# EAGLE schematic Adafruit MONSTER M4SK (EAGLE 9.4.2)

## Sheet 1 of 3: Microcontroller + Power
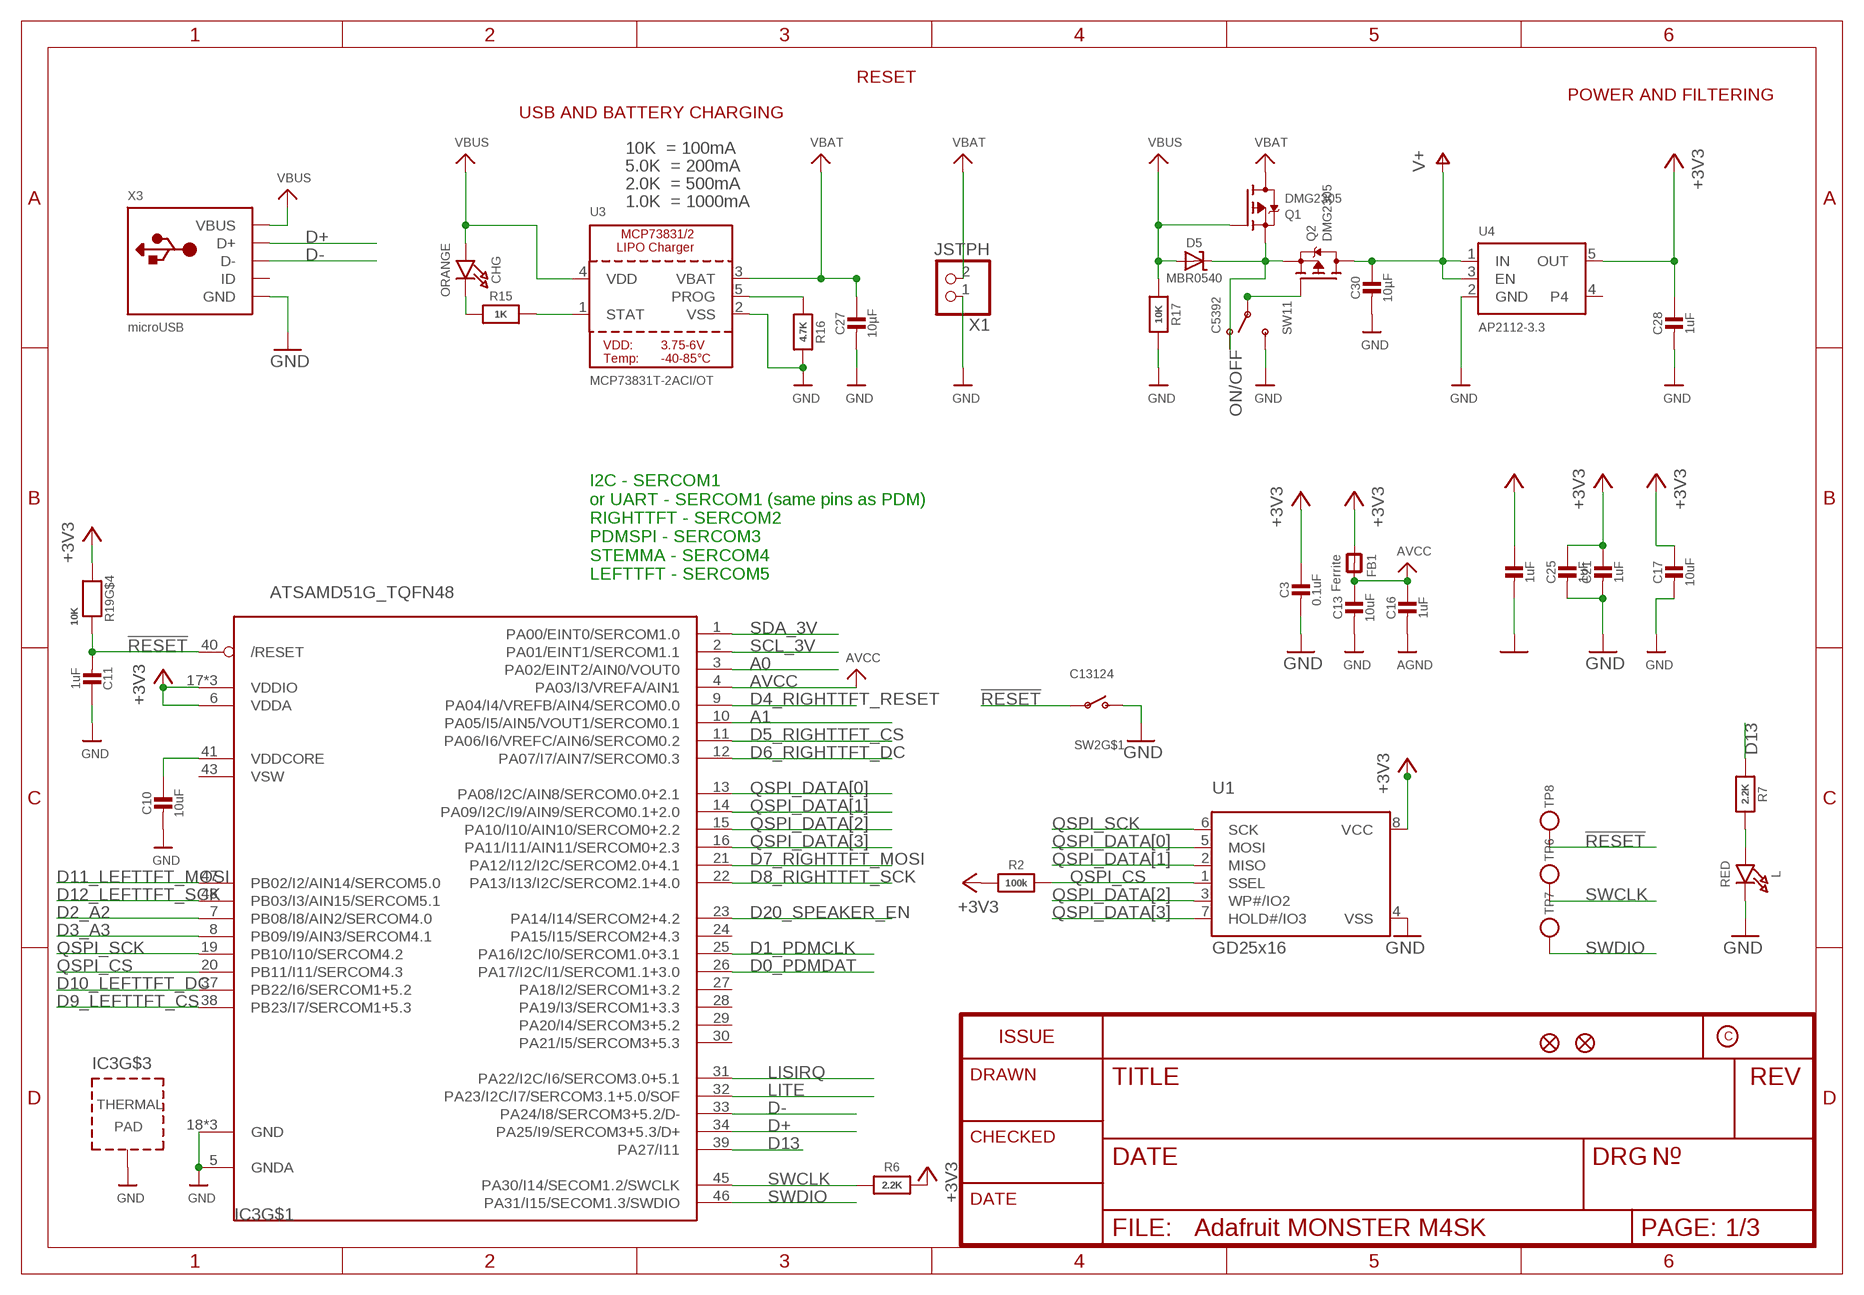
[diagram p0: schematic, sheet 1]

### Parts
C3  0.1uF  CAP_CERAMIC0603_NO  [0603-NO]
C10  10uF  CAP_CERAMIC_0805MP  [_0805MP]
C11  1uF  CAP_CERAMIC0603_NO  [0603-NO]
C13  10uF  CAP_CERAMIC0805-NOOUTLINE  [0805-NO]
C16  1uF  CAP_CERAMIC0603_NO  [0603-NO]
C17  10uF  CAP_CERAMIC0805-NOOUTLINE  [0805-NO]
C19  1uF  CAP_CERAMIC0603_NO  [0603-NO]
C21  1uF  CAP_CERAMIC0603_NO  [0603-NO]
C25  1uF  CAP_CERAMIC0603_NO  [0603-NO]
C27  10µF  CAP_CERAMIC0805-NOOUTLINE  [0805-NO]
C28  1uF  CAP_CERAMIC0603_NO  [0603-NO]
C30  10µF  CAP_CERAMIC0805-NOOUTLINE  [0805-NO]
CHG  ORANGE  LED0805_NOOUTLINE  [CHIPLED_0805_NOOUTLINE]
D5  MBR0540  DIODE-SCHOTTKYSOD-123  [SOD-123]
FB1  Ferrite  FERRITE-0805NO  [0805-NO]
IC3  ATSAMD51G_TQFN48  [TQFN48_7MM]
L  RED  LED0805_NOOUTLINE  [CHIPLED_0805_NOOUTLINE]
Q1  DMG2305  MOSFET-P  [SOT23-R]
Q2  DMG2305  MOSFET-P  [SOT23-R]
R2  100k  RESISTOR_0603_NOOUT  [0603-NO]
R6  2.2K  RESISTOR_0603_NOOUT  [0603-NO]
R7  2.2K  RESISTOR_0603_NOOUT  [0603-NO]
R15  1K  RESISTOR_0603_NOOUT  [0603-NO]
R16  4.7K  RESISTOR_0603_NOOUT  [0603-NO]
R17  10K  RESISTOR_0603_NOOUT  [0603-NO]
R19  10K  RESISTOR_4PACK  [RESPACK_4X0603]
SW2  C13124  SWITCH_SPST_TACT_RA  [SPST_TACTILE_RA]
SW11  C5392  SWITCH_SPDT  [SPDT_SMT_SSSS811101]
TP6  TESTPOINTROUND2MMNO  [TESTPOINT_ROUND_2MM_NO]
TP7  TESTPOINTROUND2MMNO  [TESTPOINT_ROUND_2MM_NO]
TP8  TESTPOINTROUND2MMNO  [TESTPOINT_ROUND_2MM_NO]
U1  GD25x16  SPIFLASH_8PIN208MIL  [SOIC8_208MIL]
U3  MCP73831T-2ACI/OT  MCP73831/2  [SOT23-5]
U4  AP2112-3.3  VREG_SOT23-5  [SOT23-5]
U$34  FIDUCIAL_1MM  [FIDUCIAL_1MM]
U$35  FIDUCIAL_1MM  [FIDUCIAL_1MM]
X1  JSTPH  CON_JST_PH_2PIN  [JSTPH2]
X3  microUSB  USB_MICRO_NARROW  [4UCONN_20329_NARROW]

### Nets
!RESET: C11.2 IC3.40(/RESET) R19.5 SW2.1(P) TP8.P$1
+3V3 [power]: C3.1 C17.1 C19.1 C21.1 C25.1 C28.1 FB1.1 IC3.6(VDDA) IC3.17(VDDIO) IC3.36(VDDIO) IC3.44(VDDIO) R2.1 R6.2 R19.4 U1.8(VCC) U4.5(OUT) ; also sheet 2
A0: IC3.3(PA02/EINT2/AIN0/VOUT0) ; also sheet 2
A1: IC3.10(PA05/I5/AIN5/VOUT1/SERCOM0.1) ; also sheet 2
AGND: C16.2 ; also sheet 2
AVCC: C13.1 C16.1 FB1.2 IC3.4(PA03/I3/VREFA/AIN1)
CHG_LED: R15.2 U3.1(STAT)
CHG_RATE: R16.1 U3.5(PROG)
D0_PDMDAT: IC3.26(PA17/I2C/I1/SERCOM1.1+3.0) ; also sheet 2
D1_PDMCLK: IC3.25(PA16/I2C/I0/SERCOM1.0+3.1) ; also sheet 2
D2_A2: IC3.7(PB08/I8/AIN2/SERCOM4.0) ; also sheet 2,3
D3_A3: IC3.8(PB09/I9/AIN3/SERCOM4.1) ; also sheet 2
D4_RIGHTTFT_RESET: IC3.9(PA04/I4/VREFB/AIN4/SERCOM0.0) ; also sheet 2
D5_RIGHTTFT_CS: IC3.11(PA06/I6/VREFC/AIN6/SERCOM0.2) ; also sheet 2
D6_RIGHTTFT_DC: IC3.12(PA07/I7/AIN7/SERCOM0.3) ; also sheet 2
D7_RIGHTTFT_MOSI: IC3.21(PA12/I12/I2C/SERCOM2.0+4.1) ; also sheet 2
D8_RIGHTTFT_SCK: IC3.22(PA13/I13/I2C/SERCOM2.1+4.0) ; also sheet 2
D9_LEFTTFT_CS: IC3.38(PB23/I7/SERCOM1+5.3) ; also sheet 2,3
D10_LEFTTFT_DC: IC3.37(PB22/I6/SERCOM1+5.2) ; also sheet 2,3
D11_LEFTTFT_MOSI: IC3.47(PB02/I2/AIN14/SERCOM5.0) ; also sheet 2,3
D12_LEFTTFT_SCK: IC3.48(PB03/I3/AIN15/SERCOM5.1) ; also sheet 2,3
D13: IC3.39(PA27/I11) R7.1
D20_SPEAKER_EN: IC3.23(PA14/I14/SERCOM2+4.2) ; also sheet 2
D+: IC3.34(PA25/I9/SERCOM3+5.3/D+) X3.D+
D-: IC3.33(PA24/I8/SERCOM3+5.2/D-) X3.D-
GND: C3.2 C10.2 C11.1 C13.2 C17.2 C19.2 C21.2 C25.2 C27.2 C28.2 C30.2 IC3.5(GNDA) IC3.18(GND) IC3.35(GND) IC3.42(GND) IC3.THERMAL(TP) L.C R16.2 R17.2 SW2.2(S) SW11.C(S) U1.4(VSS) U3.2(VSS) U4.2(GND) X1.1 X3.BASE@1(GND) X3.BASE@2(GND) X3.GND X3.SPRT@1(GND) X3.SPRT@2(GND) X3.SPRT@3(GND) X3.SPRT@4(GND) ; also sheet 2,3
LISIRQ: IC3.31(PA22/I2C/I6/SERCOM3.0+5.1) ; also sheet 2
LITE: IC3.32(PA23/I2C/I7/SERCOM3.1+5.0/SOF) ; also sheet 2
N$2: L.A R7.2
N$3: CHG.C R15.1
N$8: D5.C Q1.2(S) Q2.2(S) SW11.A(O)
ON/OFF: Q2.1(G) SW11.B(P)
QSPI_CS: IC3.20(PB11/I11/SERCOM4.3) R2.2 U1.1(SSEL)
QSPI_DATA[0]: IC3.13(PA08/I2C/AIN8/SERCOM0.0+2.1) U1.5(MOSI)
QSPI_DATA[1]: IC3.14(PA09/I2C/I9/AIN9/SERCOM0.1+2.0) U1.2(MISO)
QSPI_DATA[2]: IC3.15(PA10/I10/AIN10/SERCOM0+2.2) U1.3(WP#/IO2)
QSPI_DATA[3]: IC3.16(PA11/I11/AIN11/SERCOM0+2.3) U1.7(HOLD#/IO3)
QSPI_SCK: IC3.19(PB10/I10/SERCOM4.2) U1.6(SCK)
SCL_3V: IC3.2(PA01/EINT1/SERCOM1.1) ; also sheet 2,3
SDA_3V: IC3.1(PA00/EINT0/SERCOM1.0) ; also sheet 2,3
SWCLK: IC3.45(PA30/I14/SECOM1.2/SWCLK) R6.1 TP6.P$1
SWDIO: IC3.46(PA31/I15/SECOM1.3/SWDIO) TP7.P$1
V+ [power]: C30.1 Q2.3(D) U4.1(IN) U4.3(EN) ; also sheet 2,3
VBAT: C27.1 Q1.3(D) U3.3(VBAT) X1.2
VBUS: CHG.A D5.A Q1.1(G) R17.1 U3.4(VDD) X3.VBUS
VDDCORE: C10.1 IC3.41(VDDCORE)
Unconnected: IC3.24(PA15/I15/SERCOM2+4.3) IC3.27(PA18/I2/SERCOM1+3.2) IC3.28(PA19/I3/SERCOM1+3.3) IC3.29(PA20/I4/SERCOM3+5.2) IC3.30(PA21/I5/SERCOM3+5.3) SW2.MT1(MT) SW2.MT2(MT) U4.4 X3.ID

### Notes on the sheet
- RESET
- POWER AND FILTERING
- USB AND BATTERY CHARGING
- 10K  = 100mA
- 5.0K  = 200mA
- 2.0K  = 500mA
- 1.0K  = 1000mA
- I2C - SERCOM1
  or UART - SERCOM1 (same pins as PDM)
  RIGHTTFT - SERCOM2
  PDMSPI - SERCOM3
  STEMMA - SERCOM4
  LEFTTFT - SERCOM5

## Sheet 2 of 3: Right TFT + Audio
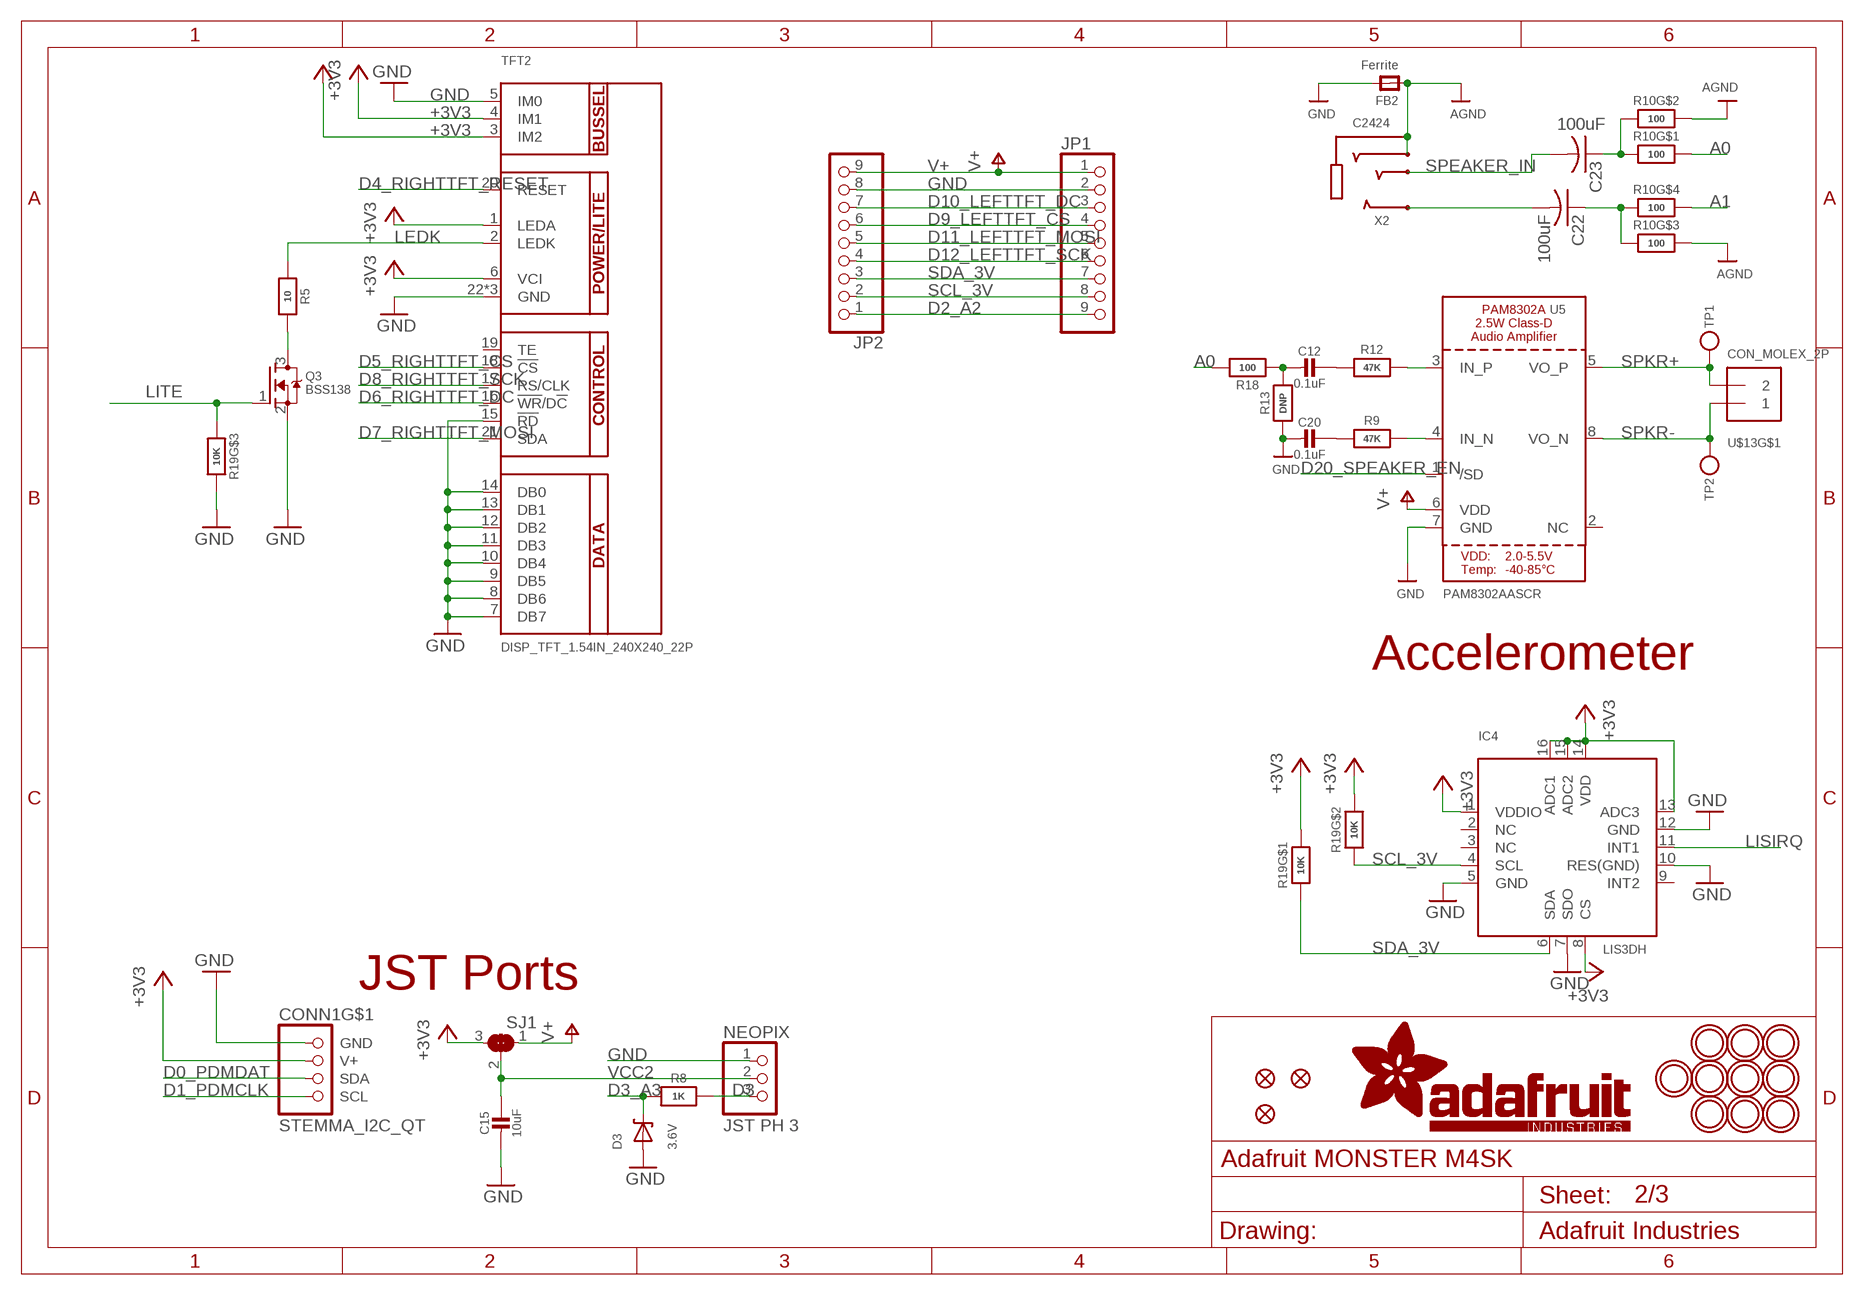
[diagram p1: schematic, sheet 2]

### Parts
C12  0.1uF  CAP_CERAMIC0603_NO  [0603-NO]
C15  10uF  CAP_CERAMIC0805-NOOUTLINE  [0805-NO]
C20  0.1uF  CAP_CERAMIC0603_NO  [0603-NO]
C22  100uF  C-USC1210  [C1210]
C23  100uF  C-USC1210  [C1210]
CONN1  STEMMA_I2C_QT  [JST_SH4]
D3  3.6V  DIODE-ZENERSOD323  [SOD-323]
FB2  Ferrite  FERRITE_0805MP  [_0805MP]
IC4  LIS3DH  ACCEL_LIS3DHTR  [LGA16_3X3MM]
JP1  HEADER-1X9_JSTSH  [JST_SH9]
JP2  HEADER-1X9_JSTSH  [JST_SH9]
NEOPIX  JST PH 3  CON_JST_PH_3PIN  [JSTPH3]
Q3  BSS138  MOSFET-NWIDE  [SOT23-WIDE]
R5  10  RESISTOR_0603_NOOUT  [0603-NO]
R8  1K  RESISTOR_0603_NOOUT  [0603-NO]
R9  47K  RESISTOR_0603_NOOUT  [0603-NO]
R10  100  RESISTOR_4PACK  [RESPACK_4X0603]
R12  47K  RESISTOR_0603_NOOUT  [0603-NO]
R13  DNP  RESISTOR_0603_NOOUT  [0603-NO]
R18  100  RESISTOR_0603_NOOUT  [0603-NO]
SJ1  SOLDERJUMPER_2WAY  [SOLDERJUMPER_2WAY_OPEN_NOPASTE]
TFT2  DISP_TFT_1.54IN_240X240_22P  [TFT_1.54IN_240X240_22PIN]
TP1  TESTPOINTROUND1.5MMNO  [TESTPOINT_ROUND_1.5MM_NO]
TP2  TESTPOINTROUND1.5MMNO  [TESTPOINT_ROUND_1.5MM_NO]
U5  PAM8302AASCR  AUDIOAMP_PAM8302A  [MSOP8_0.65MM]
U$3  FIDUCIAL_1MM  [FIDUCIAL_1MM]
U$4  FIDUCIAL_1MM  [FIDUCIAL_1MM]
U$5  FIDUCIAL_1MM  [FIDUCIAL_1MM]
U$7  MOUNTINGHOLE3.0THIN  [MOUNTINGHOLE_3.0_PLATEDTHIN]
U$8  MOUNTINGHOLE3.0THIN  [MOUNTINGHOLE_3.0_PLATEDTHIN]
U$9  MOUNTINGHOLE3.0THIN  [MOUNTINGHOLE_3.0_PLATEDTHIN]
U$10  MOUNTINGHOLE3.0THIN  [MOUNTINGHOLE_3.0_PLATEDTHIN]
U$13  CON_MOLEX_2P  [53398-0271]
U$58  MOUNTINGHOLE3.0THIN  [MOUNTINGHOLE_3.0_PLATEDTHIN]
U$59  MOUNTINGHOLE3.0THIN  [MOUNTINGHOLE_3.0_PLATEDTHIN]
U$60  MOUNTINGHOLE3.0THIN  [MOUNTINGHOLE_3.0_PLATEDTHIN]
U$61  MOUNTINGHOLE3.0THIN  [MOUNTINGHOLE_3.0_PLATEDTHIN]
U$63  MOUNTINGHOLE3.0THIN  [MOUNTINGHOLE_3.0_PLATEDTHIN]
U$64  MOUNTINGHOLE3.0THIN  [MOUNTINGHOLE_3.0_PLATEDTHIN]
X2  C2424  AUDIO_3.5MMJACK_4POL  [4UCONN_18510]

### Nets
+3V3 [power]: CONN1.2(V+) IC4.1(VDDIO) IC4.8(CS) IC4.13(ADC3) IC4.14(VDD) IC4.15(ADC2) IC4.16(ADC1) R19.1 R19.2 SJ1.3 TFT2.1(LEDA) TFT2.3(IM2) TFT2.4(IM1) TFT2.6(VCI) ; also sheet 1
A0: R10.8 R18.2 ; also sheet 1
A1: R10.5 ; also sheet 1
AGND: FB2.1 R10.6 R10.7 X2.1-GND(TIP) X2.4-INNER_SLEEVE(RING1) ; also sheet 1
D0_PDMDAT: CONN1.3(SDA) ; also sheet 1
D1_PDMCLK: CONN1.4(SCL) ; also sheet 1
D2_A2: JP1.9 JP2.1 ; also sheet 1,3
D3: NEOPIX.3 R8.1
D3_A3: D3.C R8.2 ; also sheet 1
D4_RIGHTTFT_RESET: TFT2.20(RESET) ; also sheet 1
D5_RIGHTTFT_CS: TFT2.18(!CS) ; also sheet 1
D6_RIGHTTFT_DC: TFT2.16(!WR!/D!C) ; also sheet 1
D7_RIGHTTFT_MOSI: TFT2.21(SDA) ; also sheet 1
D8_RIGHTTFT_SCK: TFT2.17(RS/CLK) ; also sheet 1
D9_LEFTTFT_CS: JP1.4 JP2.6 ; also sheet 1,3
D10_LEFTTFT_DC: JP1.3 JP2.7 ; also sheet 1,3
D11_LEFTTFT_MOSI: JP1.5 JP2.5 ; also sheet 1,3
D12_LEFTTFT_SCK: JP1.6 JP2.4 ; also sheet 1,3
D20_SPEAKER_EN: U5.1(/SD) ; also sheet 1
GND: C15.2 C20.2 CONN1.1(GND) D3.A FB2.2 IC4.5(GND) IC4.7(SDO) IC4.10(RES(GND)) IC4.12(GND) JP1.2 JP2.8 NEOPIX.1 Q3.2(S) R13.1 R19.3 TFT2.5(IM0) TFT2.7(DB7) TFT2.8(DB6) TFT2.9(DB5) TFT2.10(DB4) TFT2.11(DB3) TFT2.12(DB2) TFT2.13(DB1) TFT2.14(DB0) TFT2.15(!RD) TFT2.22(GND) TFT2.SUPPORT1(GND) TFT2.SUPPORT2(GND) U5.7(GND) ; also sheet 1,3
LEDK: R5.2 TFT2.2(LEDK)
LISIRQ: IC4.11(INT1) ; also sheet 1
LITE: Q3.1(G) R19.6 ; also sheet 1
N$1: Q3.3(D) R5.1
N$9: R9.2 U5.4(IN_N)
N$10: R12.2 U5.3(IN_P)
N$13: C12.2 R13.2 R18.1
N$14: C22.2 X2.3-OUTER_SLEEVE(RING2)
N$15: C22.1 R10.3 R10.4
N$16: C20.1 R9.1
N$17: C12.1 R12.1
N$70: C23.1 R10.1 R10.2
SCL_3V: IC4.4(SCL) JP1.8 JP2.2 R19.7 ; also sheet 1,3
SDA_3V: IC4.6(SDA) JP1.7 JP2.3 R19.8 ; also sheet 1,3
SPEAKER_IN: C23.2 X2.2-TIP(RING3)
SPKR+: TP1.P$1 U5.5(VO_P) U$13.2
SPKR-: TP2.P$1 U5.8(VO_N) U$13.1
V+ [power]: JP1.1 JP2.9 SJ1.1 U5.6(VDD) ; also sheet 1,3
VCC2 [power]: C15.1 NEOPIX.2 SJ1.2
Unconnected: CONN1.MT1(MT) CONN1.MT2(MT) IC4.2(NC) IC4.3(NC) IC4.9(INT2) TFT2.19(TE) U5.2(NC) U$13.M1(MT) U$13.M2(MT)

### Notes on the sheet
- Accelerometer
- JST Ports

## Sheet 3 of 3: Left TFT Side
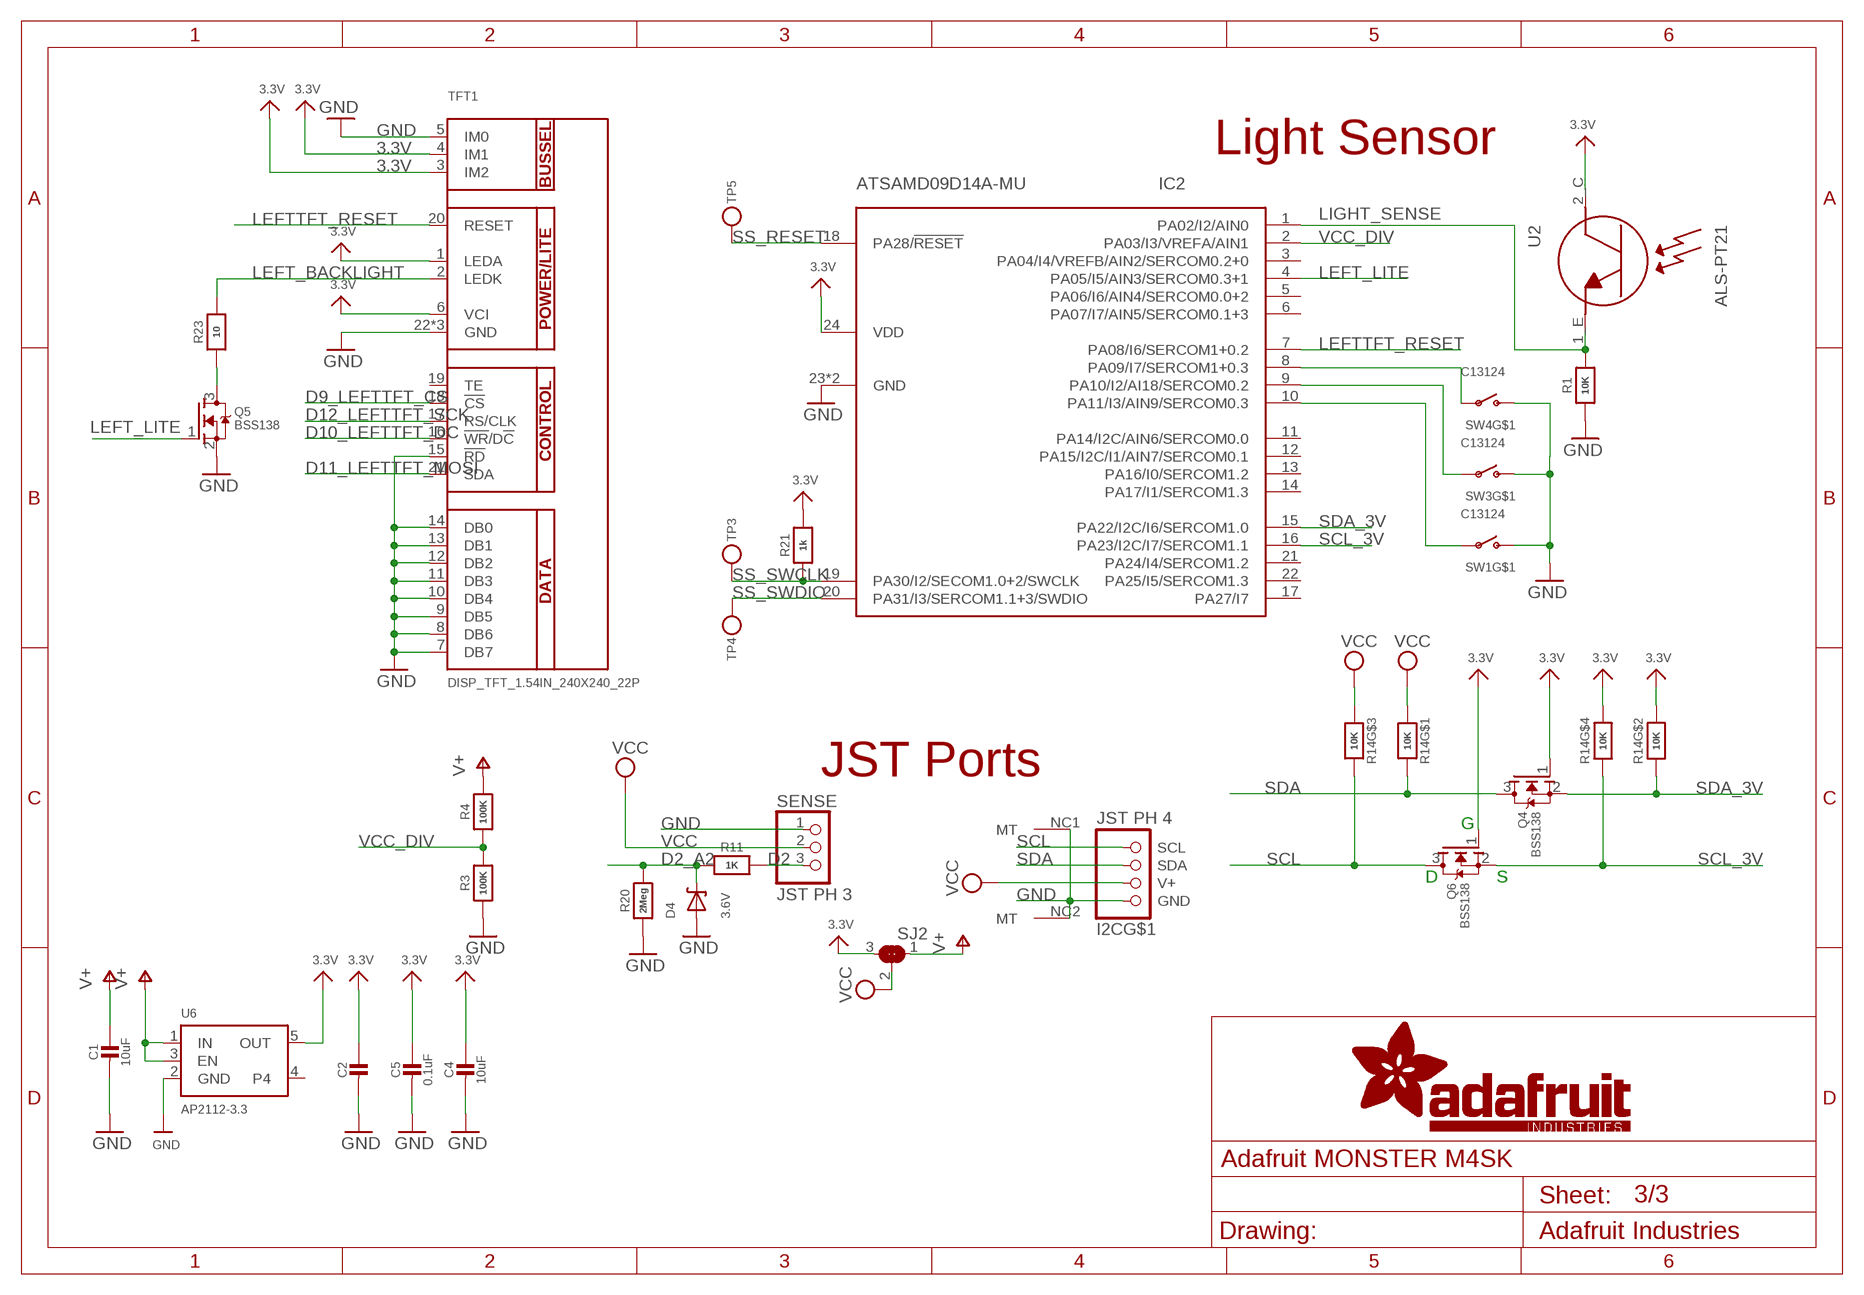
[diagram p2: schematic, sheet 3]

### Parts
C1  10uF  CAP_CERAMIC0805-NOOUTLINE  [0805-NO]
C2  10uF  CAP_CERAMIC0805-NOOUTLINE  [0805-NO]
C4  10uF  CAP_CERAMIC0805-NOOUTLINE  [0805-NO]
C5  0.1uF  CAP_CERAMIC0603_NO  [0603-NO]
D4  3.6V  DIODE-ZENERSOD323  [SOD-323]
I2C  JST PH 4  STEMMA_I2C_RASMT  [JSTPH4]
IC2  ATSAMD09D14A-MU  [QFN24_4MM]
Q4  BSS138  MOSFET-NWIDE  [SOT23-WIDE]
Q5  BSS138  MOSFET-NWIDE  [SOT23-WIDE]
Q6  BSS138  MOSFET-NWIDE  [SOT23-WIDE]
R1  10K  RESISTOR_0603_NOOUT  [0603-NO]
R3  100K  RESISTOR_0603_NOOUT  [0603-NO]
R4  100K  RESISTOR_0603_NOOUT  [0603-NO]
R11  1K  RESISTOR_0603_NOOUT  [0603-NO]
R14  10K  RESISTOR_4PACK  [RESPACK_4X0603]
R20  2Meg  RESISTOR_0603_NOOUT  [0603-NO]
R21  1k  RESISTOR_0603_NOOUT  [0603-NO]
R23  10  RESISTOR_0603_NOOUT  [0603-NO]
SENSE  JST PH 3  CON_JST_PH_3PIN  [JSTPH3]
SJ2  SOLDERJUMPER_2WAY  [SOLDERJUMPER_2WAY_OPEN_NOPASTE]
SW1  C13124  SWITCH_SPST_TACT_RA  [SPST_TACTILE_RA]
SW3  C13124  SWITCH_SPST_TACT_RA  [SPST_TACTILE_RA]
SW4  C13124  SWITCH_SPST_TACT_RA  [SPST_TACTILE_RA]
TFT1  DISP_TFT_1.54IN_240X240_22P  [TFT_1.54IN_240X240_22PIN]
TP3  TESTPOINTROUND2MM  [TESTPOINT_ROUND_2MM]
TP4  TESTPOINTROUND2MM  [TESTPOINT_ROUND_2MM]
TP5  TESTPOINTROUND2MM  [TESTPOINT_ROUND_2MM]
U2  ALS-PT21  PHOTOTRANSISTOR_PT26-21C  [ALS-PT26-21C]
U6  AP2112-3.3  VREG_SOT23-5  [SOT23-5]

### Nets
3.3V: C2.1 C4.1 C5.1 IC2.24(VDD) Q4.1(G) Q6.1(G) R14.2 R14.4 R21.2 SJ2.3 TFT1.1(LEDA) TFT1.3(IM2) TFT1.4(IM1) TFT1.6(VCI) U2.2_C(C) U6.5(OUT)
D2: R11.1 SENSE.3
D2_A2: D4.C R11.2 R20.2 ; also sheet 1,2
D9_LEFTTFT_CS: TFT1.18(!CS) ; also sheet 1,2
D10_LEFTTFT_DC: TFT1.16(!WR!/D!C) ; also sheet 1,2
D11_LEFTTFT_MOSI: TFT1.21(SDA) ; also sheet 1,2
D12_LEFTTFT_SCK: TFT1.17(RS/CLK) ; also sheet 1,2
GND: C1.2 C2.2 C4.2 C5.2 D4.A I2C.1(GND) I2C.NC1(MT) I2C.NC2(MT) IC2.23(GND) IC2.THERM(GND) Q5.2(S) R1.1 R3.1 R20.1 SENSE.1 SW1.2(S) SW3.2(S) SW4.2(S) TFT1.5(IM0) TFT1.7(DB7) TFT1.8(DB6) TFT1.9(DB5) TFT1.10(DB4) TFT1.11(DB3) TFT1.12(DB2) TFT1.13(DB1) TFT1.14(DB0) TFT1.15(!RD) TFT1.22(GND) TFT1.SUPPORT1(GND) TFT1.SUPPORT2(GND) U6.2(GND) ; also sheet 1,2
LEFT_BACKLIGHT: R23.2 TFT1.2(LEDK)
LEFT_LITE: IC2.4(PA05/I5/AIN3/SERCOM0.3+1) Q5.1(G)
LEFTTFT_RESET: IC2.7(PA08/I6/SERCOM1+0.2) TFT1.20(RESET)
LIGHT_SENSE: IC2.1(PA02/I2/AIN0) R1.2 U2.1_E(E)
N$6: Q5.3(D) R23.1
N$7: IC2.8(PA09/I7/SERCOM1+0.3) SW4.1(P)
N$11: IC2.9(PA10/I2/AI18/SERCOM0.2) SW3.1(P)
N$12: IC2.10(PA11/I3/AIN9/SERCOM0.3) SW1.1(P)
SCL: I2C.4(SCL) Q6.3(D) R14.6
SCL_3V: IC2.16(PA23/I2C/I7/SERCOM1.1) Q6.2(S) R14.5 ; also sheet 1,2
SDA: I2C.3(SDA) Q4.3(D) R14.8
SDA_3V: IC2.15(PA22/I2C/I6/SERCOM1.0) Q4.2(S) R14.7 ; also sheet 1,2
SS_RESET: IC2.18(PA28/!RESET) TP5.P$1
SS_SWCLK: IC2.19(PA30/I2/SECOM1.0+2/SWCLK) R21.1 TP3.P$1
SS_SWDIO: IC2.20(PA31/I3/SERCOM1.1+3/SWDIO) TP4.P$1
V+ [power]: C1.1 R4.2 SJ2.1 U6.1(IN) U6.3(EN) ; also sheet 1,2
VCC [power]: I2C.2(V+) R14.1 R14.3 SENSE.2 SJ2.2
VCC_DIV: IC2.2(PA03/I3/VREFA/AIN1) R3.2 R4.1
Unconnected: IC2.3(PA04/I4/VREFB/AIN2/SERCOM0.2+0) IC2.5(PA06/I6/AIN4/SERCOM0.0+2) IC2.6(PA07/I7/AIN5/SERCOM0.1+3) IC2.11(PA14/I2C/AIN6/SERCOM0.0) IC2.12(PA15/I2C/I1/AIN7/SERCOM0.1) IC2.13(PA16/I0/SERCOM1.2) IC2.14(PA17/I1/SERCOM1.3) IC2.17(PA27/I7) IC2.21(PA24/I4/SERCOM1.2) IC2.22(PA25/I5/SERCOM1.3) SW1.MT1(MT) SW1.MT2(MT) SW3.MT1(MT) SW3.MT2(MT) SW4.MT1(MT) SW4.MT2(MT) TFT1.19(TE) U6.4

### Notes on the sheet
- Light Sensor
- JST Ports
- G
- D | S

## Power pins joined to a net without a drawn wire
VSW: IC3.43(VSW)

## Library data of the parts
C1-C5 C10-C13 C15-C17 C19-C21 C25 C27 C28 C30 = microbuilder:CAP_CERAMIC: Ceramic Capacitors For new designs, use the packages preceded by an '_' character since they are more reliable: The following footprints should be used on most boards: _0402 - Standard footprint for regular board layouts _0603 - Standard footprint for regular board layouts _0805 - Standard footprint for regular board layouts _1206 - Standard footprint for regular board layouts For extremely tight-pitch boards where space is at a premium, the following 'micro-pitch' footprints can be used (smaller pads, no silkscreen outline, etc.): _0402MP - Micro-pitch footprint for very dense/compact boards _0603MP - Micro-pitch footprint for very dense/compact boards _0805MP - Micro-pitch footprint for very dense/compact boards _1206MP - Micro-pitch footprint for very dense/compact boards
C22 C23 = resistor:C-US: CAPACITOR, American symbol
CHG L = microbuilder:LED: LED 0603 - 0603 Surface Mount Package 2mA: Green LED - Low Power (3.9mcd, 2ma, 1.7Vf) - Digikey: 475-2709-2-ND Orange LED - Low Power (9.8mcd, 2ma, 1.8Vf) - Digikey: 475-1194-2-ND Red LED - Low Power (5mcd, 2ma, 1.8Vf) - Digikey: 475-1195-2-ND Yellow LED - Low Power (7mcd, 2ma, 1.8Vf) - Digikey: 475-1196-2-ND 5mA: Blue LED - Low Power (17mcd, 5ma, 2.9Vf) - Digikey: LNJ937W8CRACT-ND 0805 - 0805 Surface Mount Package 2mA: Red LED (8.8mcd, 2mA, 1.8Vf, Clear) - Low Power [Digikey: 475-2510-1-ND] Green LED (5mcd, 2mA, 1.8Vf, Clear) - Low Power [Digikey: 475-2730-1-ND] Yellow LED (11.3mcd, 2mA, 1.8Vf, Clear) - Low Power [Digikey: 475-2555-1-ND] 20mA: Red LED (104mcd, 20mA, Diffused) - LS R976 [Digikey: 475-1278-6-ND] Red LED (12mcd, 20mA, 2.0Vf, Clear) - APT2012EC [Digikey: 754-1128-1-ND] Green LED (15mcd, 20mA, 2.2Vf, Clear) - APT2012GC [Digikey: 754-1131-1-ND] Orange LED (160mcd, 20mA, 2.1Vf, Clear) - APT2012SECK [Digikey: 754-1130-1-ND] 1206 - 1206 Surface Mount Package Green LED (26mcd, 20mA, Diffused) - LG N971 [Digikey: 475-1407-6-ND] Red LED (15mcd, 20mA, Diffused) - LH N974 [Digikey: 475-1416-6-ND] Cree - Cree High-Power Surface Mount LEDs XPEBWT-L1-0000-00D50 - White 111lm 350mA 2.9Vf 6200K 110° XTEAWT-00-0000-00000LEE3 - White 114lm 350mA 2.85Vf 5000K 115° Everlight - Everlight 45-21 Series Surface Mount LEDs 45-21/QK2C-B2832AC2CB2/2T - Warm White 2000mcd 20mA 3.25Vf 3050K 120° 45-21/LK2C-B38452C4CB2/2T - Nuetral White 2000mcd 20mA 3.25Vf 4150K 120° 45-21/LK2C-B50634C6CB2/2T - Cold White 2200mcd 20mA 3.25Vf 5650K 120° PLCC2 Reverse Mount LS T77K-J1L2-1-0-2-R18-Z - Red 11.25mcd 2mA 1.8Vf 630nm 120° LO T77K-L1M2-24-Z - Orange 19.6mcd 2mA 1.8Vf 606nm 120° LY T77K-K2M1-26-Z - Yellow 15.7mcd 2mA 1.8Vf 587nm 120°
CONN1 I2C = microbuilder:STEMMA_I2C
D3 D4 = microbuilder:DIODE-ZENER: Zener Diode SMA: 30V 1W Zener Diode, 1.2Vf - Digikey: SMAZ30-FDICT-ND
D5 = microbuilder:DIODE-SCHOTTKY
FB1 FB2 = microbuilder:FERRITE: Ferrite Bead 0603 MMZ1608B121C - 120 Ohm @ 100MHz, 600mA, 0.15 Ohm DC Resistance - Digikey: 445-2164-1-ND BK1608HW121-T - 120 Ohm, 600mA Ferrite Chip - Digikey: 587-1876-2-ND 0805 HZ0805B272R-10 - 2.7K Ohm @ 100MHz, 200mA, 0.8 Ohm DC Resistance - Digikey: 240-2504-1-ND (see also Murata BLM21BD272SN1L) MMZ2012Y152B - 1.5K Ohm @ 100MHz, 500mA, 0.4 Ohm DC Resistance - Digikey: 445-1560-1-ND - Mainly for high frequency (80-400MHz) MMZ2012R102A - 1K Ohm @ 100MHz, 500mA, 0.3 Ohm DC Resistance - Digikey: 445-1555-2-ND - More general purpose (10-200MHz)
IC2 = microbuilder:ATSAMD09D14A
IC3 = microbuilder:ATSAMD51G
IC4 = microbuilder:ACCEL_LIS3DHTR: LIS3DHTR 3-Axis Accelerometer with I2C/SPI Interface VDD: 1.71-3.6V VDDIO: 1.71-VDD+0.1V Scale: +/-2g, 4g, 8g, 16g with 16--bit data output Temp:: -40°C - 85°C Mouser: 511-LIS3DHTR Digikey: 497-10613-1-ND
JP1 JP2 = microbuilder:HEADER-1X9: PIN HEADER
NEOPIX SENSE = microbuilder:CON_JST_PH_3PIN
Q1 Q2 = microbuilder:MOSFET-P: P-Channel Mosfet LEGEND VDS: Voltage Drain-Source ID: Drain Current RDS(ON): Drain-Source On-State Resistance VGS(TH): Gate-Source Threshold Voltage CISS: Drain-Source Input Capacitance SOT-23 Name VDS ID RDS(ON) VGS(TH) CISS Order Number IRLML5103 30V 760mA 600 mOhm -- 75pF @ 25V Digikey: IRLML5103PBFCT-ND IRLML6401 12V 4.3A 50 mOhm 950mV @ 250µA 830pF @ 10V Digikey: IRLML6401PBFTR-ND NTR0202PL 20V 400mA 800 mOhm 2.3V @ 250uA 70pF @ 5V Digikey: NTR0202PLT1GOSTR-ND NTR4101PT1G 20V 1.8A 85 mOhm 1.2V @ 250uA 675pF @ 10V Digikey: NTR4101PT1GOSCT-ND DMP2004K 20V 600mA 900 mOhm 1V @ 250uA 175pF @ 16V Digikey: DMP2004KDICT-ND PMV65XP 20V 3.9A 76 mOhm 950mV @ 1mA 725pF @ 20V Digikey: 568-2358-2-ND TO-252 Name VDS ID RDS(ON) VGS(TH) CISS Order Number AOD417 30V 25A 34 mOhm 3V @ 250µA 920pF @ 15V Digikey: 785-1106-2-ND PowerPak Name VDS ID RDS(ON) VGS(TH) CISS Order Number AON7401 30V 12A 14 mOhm 3V @ 250µA 2600pF @ 15V Digikey: 785-1302-1-ND
Q3-Q6 = microbuilder:MOSFET-N: N-Channel Mosfet LEGEND VDS: Voltage Drain-Source ID: Drain Current RDS(ON): Drain-Source On-State Resistance VGS(TH): Gate-Source Threshold Voltage CISS: Drain-Source Input Capacitance SOT-23 Name VDS ID RDS(ON) VGS(TH) CISS Order Number 2N7002E 60V 260mA 2.5 Ohm 2.5V @ 250uA 26.7pF @ 25V 2N7002ET1GOSTR-ND BSH103 30V 850mA 400 mOhm 400mV @ 1mA 83pF @ 24V BSH103,235-ND BSS138 60V 320mA 1.6 Ohm 1.5V @ 250uA 50pF @ 10V Mouser: 771-BSS138PW115 DMN2075U-7 20V 4.2A 38 mOhm 1V @ 250 uA 594.3pF @ 10V DMN2075U-7DICT-ND * BSS138 good choice for I2C level-shifting POWERPAK 1212-8 Name VDS ID RDS(ON) VGS(TH) CISS Order Number Si7308DN 60V 6A 58 mOhm 3V @ 250uA 665pF @ 15V SI7308DN-T1-E3CT-ND
R1-R9 R11-R13 R15-R18 R20 R21 R23 = microbuilder:RESISTOR: Resistors For new designs, use the packages preceded by an '_' character since they are more reliable: The following footprints should be used on most boards: _0402 - Standard footprint for regular board layouts _0603 - Standard footprint for regular board layouts _0805 - Standard footprint for regular board layouts _1206 - Standard footprint for regular board layouts For extremely tight-pitch boards where space is at a premium, the following 'micro-pitch' footprints can be used (smaller pads, no silkscreen outline, etc.): _0402MP - Micro-pitch footprint for very dense/compact boards _0603MP - Micro-pitch footprint for very dense/compact boards _0805MP - Micro-pitch footprint for very dense/compact boards _1206MP - Micro-pitch footprint for very dense/compact boards
R10 R14 R19 = microbuilder:RESISTOR_4PACK: Resistor Packs (4 resistors) 4 x 0603 10K 1/16W - Digikey: YC164J-10KCT-ND
SJ1 SJ2 = microbuilder:SOLDERJUMPER_2WAY: 2-Way Solder Jumper
SW1-SW4 = microbuilder:SWITCH_SPST: Switch - SPST 4UCon 19192 (6.7x2.6mm SMT)
SW11 = microbuilder:SWITCH_SPDT: Switch - SPDT SSSS811101 - Horizontal Two Position SMT, 0.3A 4V [Mouser: 688-SSSS811101]
TFT1 TFT2 = microbuilder:DISP_TFT_1.54IN_240X240_22P
TP1-TP8 = microbuilder:TESTPOINT: Test Point Various test points for characterisation and PCB testing TESTPOINT_SMT - Compact Surface Mount Test Point [Digikey: 5016KTR-ND]
U1 = microbuilder:SPIFLASH_8PIN: SOIC8 SPI Flash Be careful with the size since SOIC8 flash comes in several 'widths' SOIC8 150 mil M25P16 - 16Mbit (2Mbit x 8) Serial Flash (75MHz SPI Bus), Supply: 2.7-3.6V Digikey: SOIC8 - M25P16-VMN6P-ND SOIC8 208 mil W25Q16BVSSIG - 16Mbit (2Mbit x 8) Serial Flash (104MHz SPI Bus), Supply: 2.7-3.6V Digikey: SOIC8 - W25Q16BVSSIG-ND
U2 = microbuilder:PHOTOTRANSISTOR: ALS-PT19-315C - Analog Light Sensor VCC: 2.5-5.5V
U3 = microbuilder:MCP73831/2: MCP73831/2 LIPO Charger VDD: 3.75 - 6V Temp -40 - 85°C Programmable Charge Rate: 15-500mA NOTE: STAT is a tri-state logic output on the MCP73831 and an open-drain output on the MCP73832. SOT23-5 with 4.2V output and tri-state logic on STAT = MCP73831T-2ACI/OT
U4 U6 = microbuilder:VREG_SOT23-5: SOT23-5 Fixed Voltage Regulators Part Current Out V Out V In V Dropout θJA (°C/W) TJ (°C) Digikey Part No. ADP121 150mA 3.3V 3.4-5.5V 0.09V @ 150mA -- -- ADP121-AUJZ33R7CT-ND ADP121 150mA 3.0V 3.1-5.5V 0.09V @ 150mA -- -- ADP121-AUJZ30R7CT-ND ADP122 300mA 3.3V 3.4-5.5V 0.085V @ 300mA -- -- ADP122AUJZ-3.3-R7CT-ND ADP1712 300mA 3.3V 3.5-5.5V 0.17V @ 300mA -- -- ADP1712AUJZ-3.3-R7TR-ND AP7311 (Low Cost) 150mA 3.3V 3.5-6V 0.15V @ 150mA -- -- AP7311-33WG-7DICT-ND LD39015M18R 150mA 1.8V 1.9V-5.5V 0.08V @ 100mA -- -- 497-6977-1-ND LP2985A-33DBVR 150mA 3.3V 3.3-16V 0.28V @ 150mA 206 150 296-18479-1-ND MCP1824T-3302E/OT 300mA 3.3V 3.5V-6V 0.2V @ 300mA -- -- MCP1824T-3302E/OTCT-ND MIC5205-2.5YM5 TR 150mA 2.5V 2.7-16V 0.165V @ 150mA -- -- 576-1257-2-ND MIC5205-3.0YM5 TR 150mA 3.0V 3.2V-16V 0.165V @ 150mA -- -- 576-1258-2-ND MIC5205-3.3YM5 TR 150mA 3.3V 3.5V-16V 0.165V @ 150mA -- -- 576-1259-2-ND TPS780330220 150mA 3.3V+2.2V 3.6-5.5V 250mV Max -- -- 296-23332-1-ND TDA3663/N1,135 100mA 3.3V 3.5-45V 0.18V @ 50mA -- -- 568-5343-1-ND Max operating temp can be calculated using θJA, TJ (max junction temperature), and power in watts. Set the "Maximum Ambient Temperature" until it reaches TJ ("Max Junction Temperature"), which is the absolute limit for safe use of the regulator: Heat Sink Temperature Calculator <http://www.daycounter.com/Calculators/Heat-Sink-Temperature-Calculator.phtml> For example, With 12V source into a 3.3V LP2985 and a 30mA load, we are dissipating (12V-3.3V) * 0.03A = 0.261W. With a θJA of 206 °C/W, a TJ of 150°C, and 261mW we can safely use the chip without a heat sink up to 75°C (=147.1°C Junction Temperature).
U5 = microbuilder:AUDIOAMP_PAM8302A: PAM8302A - 2.5W Class-D Mono Audio Amplifier MSOP8 = PAM8302AASCR
U$3-U$5 U$34 U$35 = microbuilder:FIDUCIAL: Fiducial Alignment Points Various fiducial points for machine vision alignment.; BOM: EXCLUDE
U$7-U$10 U$58-U$61 U$63 U$64 = microbuilder:MOUNTINGHOLE: Mounting Hole For #2 screws (0.086"/2.18mm width, 0.094"/2.4mm hole) use 2.5mm; BOM: EXCLUDE
U$13 = microbuilder:CON_MOLEX_2P
X1 = microbuilder:CON_JST_PH_2PIN: JST 2-Pin Right-Angle Connector PH-Series - 4UConnector: 17311 SH-Series - 4UConnector: 07278
X2 = microbuilder:AUDIO_3.5MMJACK_4POL: Footprint courtesy Morten Hjerde (Riftlabs.com) These are normally connected as follows (4-pin 3.5mm 'TRRS'), from left-to right on the schematic symbol above: Tip: Left Audio Outermost Ring: Right Audio Innermost Ring: Common/GND Shell: Mic+
X3 = microbuilder:USB: USB Connectors USBMINIB - Surface Mount Female Mini-B USB Connector 4UConnector: 06564

## Net classes
1 power: width 0.305 mm